# Altium schematic sheet PCB_3U_RJ45.schdoc: 3U RJ45
size 420 x 297 mm; Author: G.K.; CompanyName: WUT; DrawnBy: G.K.; Organization: CERN; Address1: Warsaw Univeristy of Technology; Address2: Nowowiejska 15/19; Revision: -; SheetNumber: -; SheetTotal: -; EDA_Number: ARTIQ; Projet: KASLI 3U subsystem; ModifiedBy: -; CreateDate: XX/XX/XXXX; CheckedDate: -; Title2: Extension board; DivGrp: ISE; Designer: G.K.; ModifiedDate: -; ProjectName: KASLI 3U subsystem
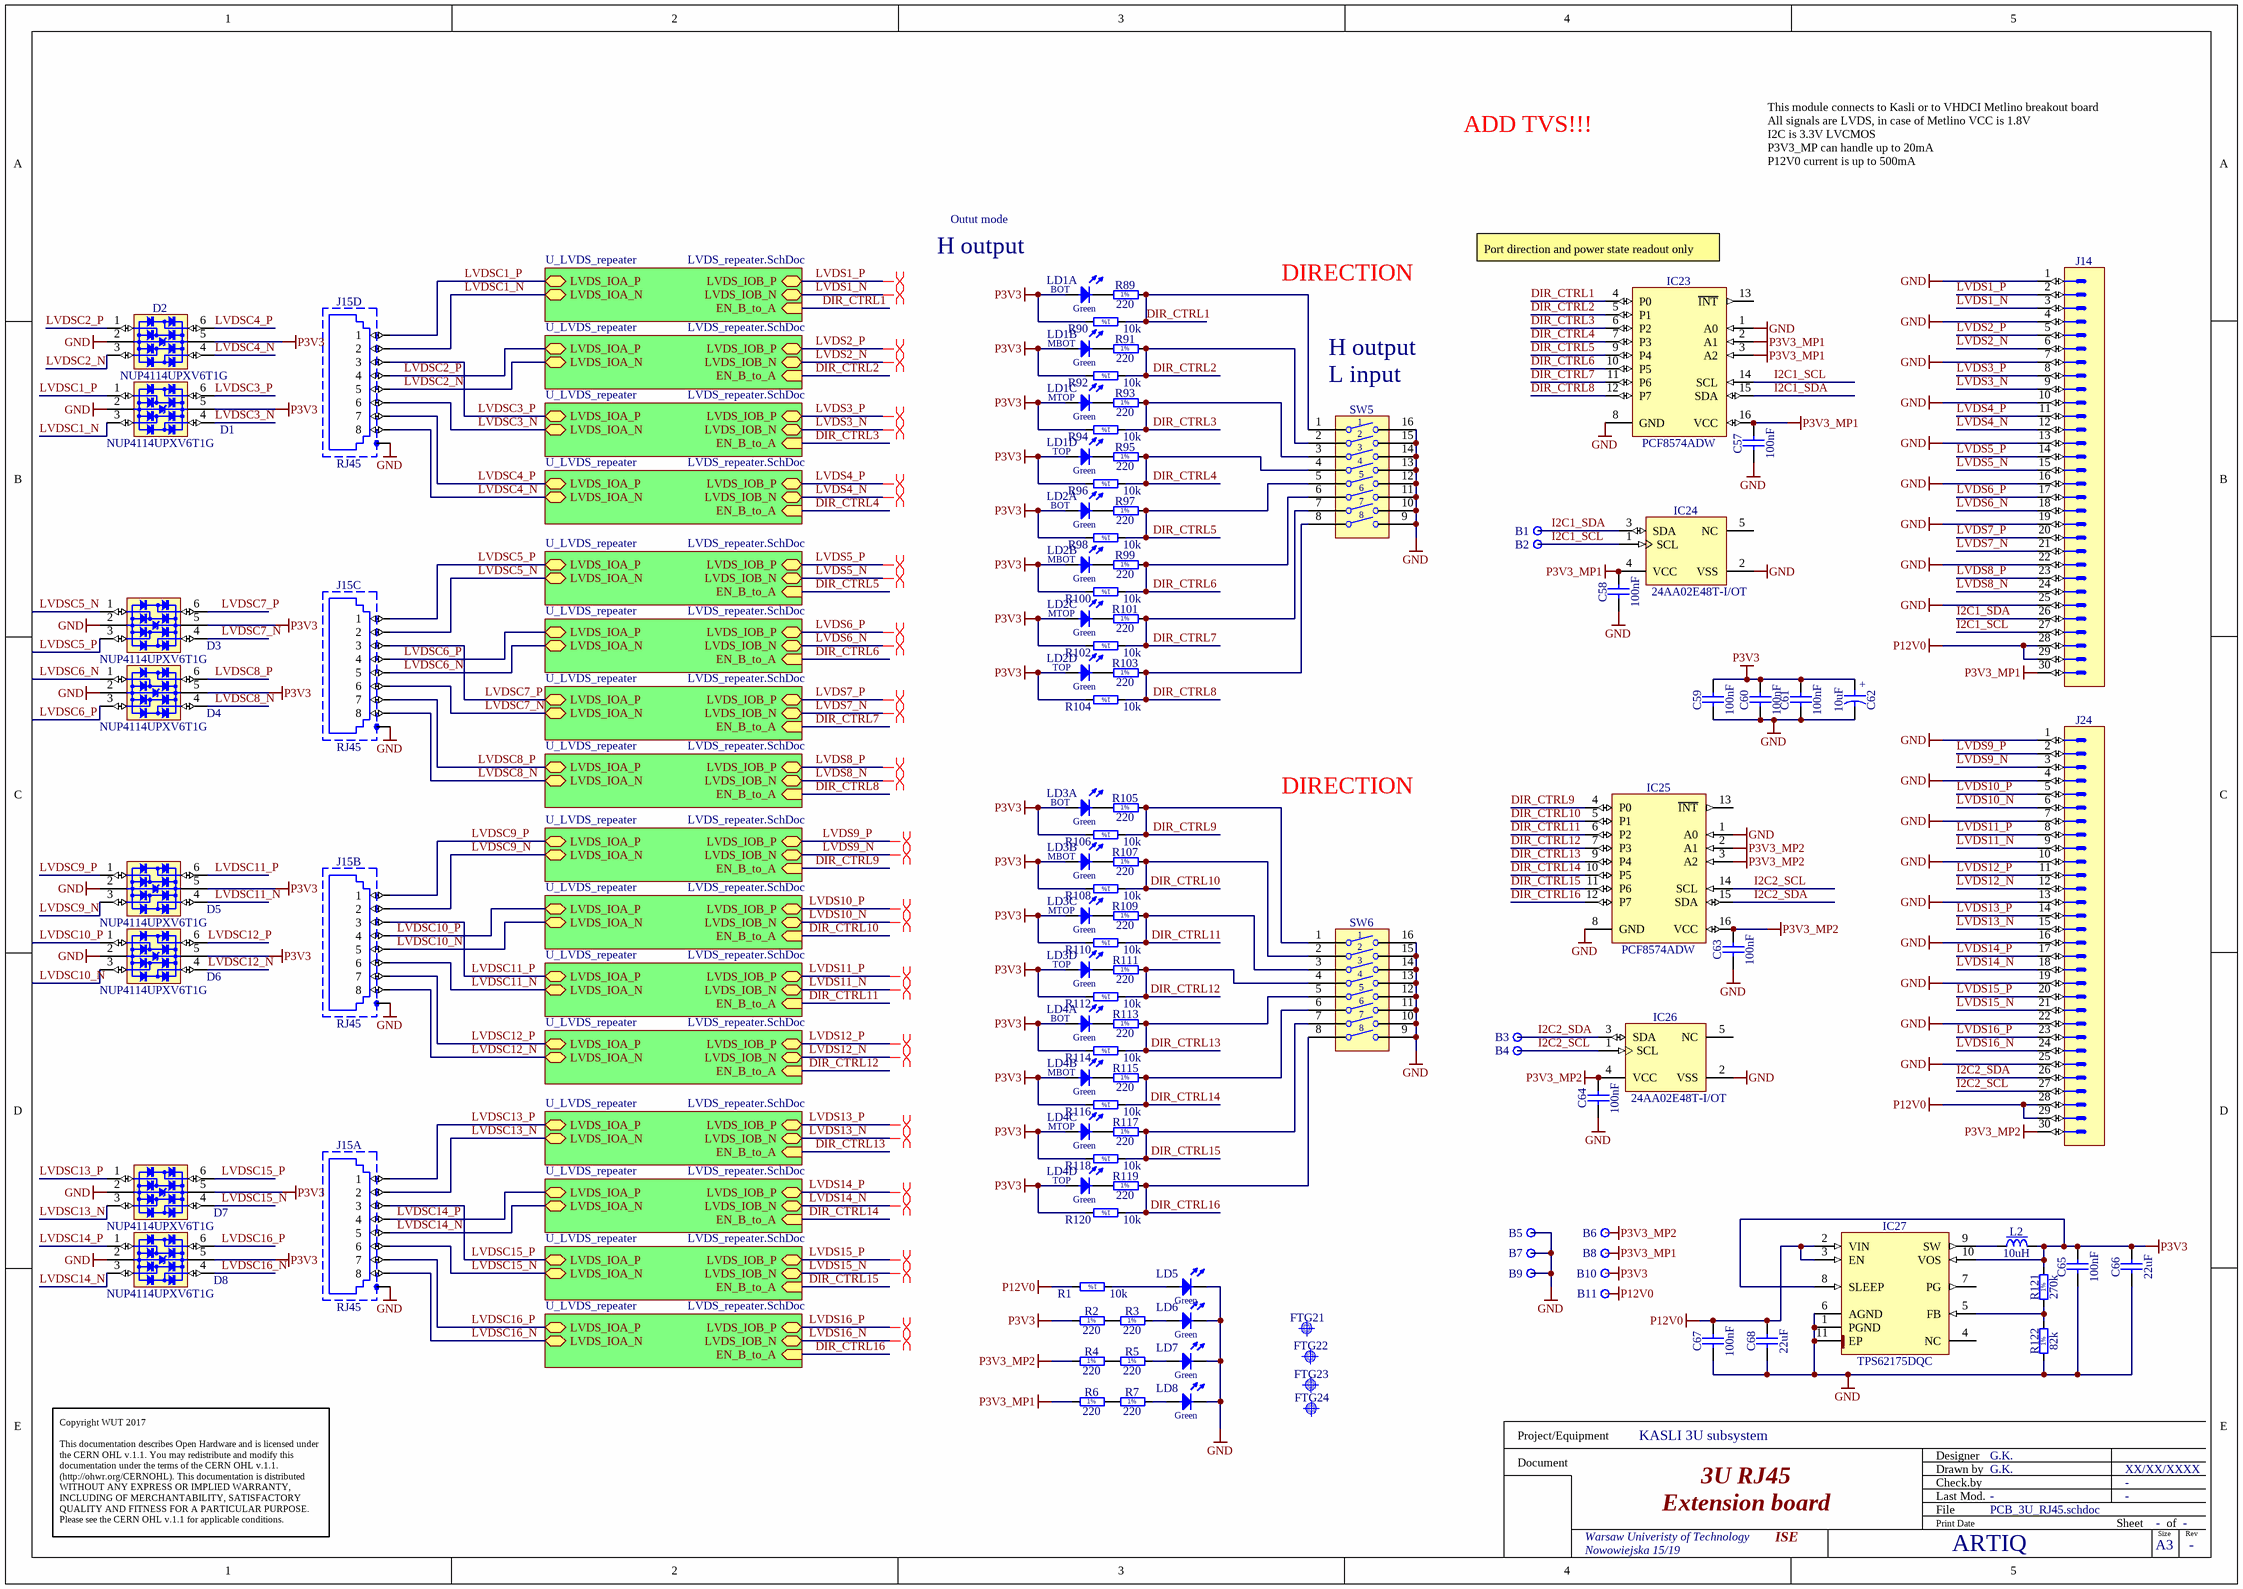
[diagram p0: PCB_3U_RJ45.schdoc]

## Parts
B1  Plated Hole  [c130h60]  (value not drawn)
B2  Plated Hole  [c130h60]  (value not drawn)
B3  Plated Hole  [c130h60]  (value not drawn)
B4  Plated Hole  [c130h60]  (value not drawn)
B5  Plated Hole  [c130h60]  (value not drawn)
B6  Plated Hole  [c130h60]  (value not drawn)
B7  Plated Hole  [c130h60]  (value not drawn)
B8  Plated Hole  [c130h60]  (value not drawn)
B9  Plated Hole  [c130h60]  (value not drawn)
B10  Plated Hole  [c130h60]  (value not drawn)
B11  Plated Hole  [c130h60]  (value not drawn)
C57  100nF  [CAPC1005X55N]
C58  100nF  [CAPC1005X55N]
C59  100nF  [CAPC1005X55N]
C60  100nF  [CAPC1005X55N]
C61  100nF  [CAPC1005X55N]
C62  10uF  [CAPAE430X540N]
C63  100nF  [CAPC1005X55N]
C64  100nF  [CAPC1005X55N]
C65  100nF  [CAPC1005X55N]
C66  22uF  [CAPC2012X135N]
C67  100nF  [CAPC1005X55N]
C68  22uF  [CAPC2012X135N]
D1  NUP4114UPXV6T1G  [SOTFL50P160X60-6N]
D2  NUP4114UPXV6T1G  [SOTFL50P160X60-6N]
D3  NUP4114UPXV6T1G  [SOTFL50P160X60-6N]
D4  NUP4114UPXV6T1G  [SOTFL50P160X60-6N]
D5  NUP4114UPXV6T1G  [SOTFL50P160X60-6N]
D6  NUP4114UPXV6T1G  [SOTFL50P160X60-6N]
D7  NUP4114UPXV6T1G  [SOTFL50P160X60-6N]
D8  NUP4114UPXV6T1G  [SOTFL50P160X60-6N]
FTG21  Use only in PCB  [FIDUCIAL_TOP_C100-200]  (value not drawn)
FTG22  Use only in PCB  [FIDUCIAL_TOP_S100-200]  (value not drawn)
FTG23  Use only in PCB  [FIDUCIAL_TOP_S200-400]  (value not drawn)
FTG24  Use only in PCB  [FIDUCIAL_TOP_S100-200]  (value not drawn)
IC23  PCF8574ADW  [SOIC127P1030X265-16N]
IC24  24AA02E48T-I/OT  [SOT95P280X145-5N]
IC25  PCF8574ADW  [SOIC127P1030X265-16N]
IC26  24AA02E48T-I/OT  [SOT95P280X145-5N]
IC27  TPS62175DQC  [SON50P200X300X80-11N-R94X250]
J14  (no value)  [3M_N2530-6002RB]
J15  RJ45  [TYCO_5406203-3]  (parts A,B,C,D of 4)
J24  (no value)  [3M_N2530-6002RB]
L2  10uH  [IND_MURATA-PS_8400]
LD1  Green  [LED_BIVAR_H485CGDL]  (value not drawn)  (parts A,B,C,D of 4)
LD2  Green  [LED_BIVAR_H485CGDL]  (value not drawn)  (parts A,B,C,D of 4)
LD3  Green  [LED_BIVAR_H485CGDL]  (value not drawn)  (parts A,B,C,D of 4)
LD4  Green  [LED_BIVAR_H485CGDL]  (value not drawn)  (parts A,B,C,D of 4)
LD5  Green  [LED_KINGBRIGHT_KPH-1608CGCK]  (value not drawn)
LD6  Green  [LED_KINGBRIGHT_KPH-1608CGCK]  (value not drawn)
LD7  Green  [LED_KINGBRIGHT_KPH-1608CGCK]  (value not drawn)
LD8  Green  [LED_KINGBRIGHT_KPH-1608CGCK]  (value not drawn)
R1  10k  [RESC1005X40N]
R2  220  [RESC1608X55N]
R3  220  [RESC1608X55N]
R4  220  [RESC1608X55N]
R5  220  [RESC1608X55N]
R6  220  [RESC1608X55N]
R7  220  [RESC1608X55N]
R89  220  [RESC1608X55N]
R90  10k  [RESC1005X40N]
R91  220  [RESC1608X55N]
R92  10k  [RESC1005X40N]
R93  220  [RESC1608X55N]
R94  10k  [RESC1005X40N]
R95  220  [RESC1608X55N]
R96  10k  [RESC1005X40N]
R97  220  [RESC1608X55N]
R98  10k  [RESC1005X40N]
R99  220  [RESC1608X55N]
R100  10k  [RESC1005X40N]
R101  220  [RESC1608X55N]
R102  10k  [RESC1005X40N]
R103  220  [RESC1608X55N]
R104  10k  [RESC1005X40N]
R105  220  [RESC1608X55N]
R106  10k  [RESC1005X40N]
R107  220  [RESC1608X55N]
R108  10k  [RESC1005X40N]
R109  220  [RESC1608X55N]
R110  10k  [RESC1005X40N]
R111  220  [RESC1608X55N]
R112  10k  [RESC1005X40N]
R113  220  [RESC1608X55N]
R114  10k  [RESC1005X40N]
R115  220  [RESC1608X55N]
R116  10k  [RESC1005X40N]
R117  220  [RESC1608X55N]
R118  10k  [RESC1005X40N]
R119  220  [RESC1608X55N]
R120  10k  [RESC1005X40N]
R121  270k  [RESC1608X55N]
R122  82k  [RESC1608X55N]
SW5  Switch  [SW_TYCO_1-1571983-0]  (value not drawn)
SW6  Switch  [SW_TYCO_1-1571983-0]  (value not drawn)

## Sub-sheets
U_LVDS_repeater = LVDS_repeater.SchDoc: LVDS_IOA_P (bidir), LVDS_IOA_N (bidir), LVDS_IOB_P (bidir), LVDS_IOB_N (bidir), EN_B_to_A (in)
U_LVDS_repeater = LVDS_repeater.SchDoc: LVDS_IOA_P (bidir), LVDS_IOA_N (bidir), LVDS_IOB_P (bidir), LVDS_IOB_N (bidir), EN_B_to_A (in)
U_LVDS_repeater = LVDS_repeater.SchDoc: LVDS_IOA_P (bidir), LVDS_IOA_N (bidir), LVDS_IOB_P (bidir), LVDS_IOB_N (bidir), EN_B_to_A (in)
U_LVDS_repeater = LVDS_repeater.SchDoc: LVDS_IOA_P (bidir), LVDS_IOA_N (bidir), LVDS_IOB_P (bidir), LVDS_IOB_N (bidir), EN_B_to_A (in)
U_LVDS_repeater = LVDS_repeater.SchDoc: LVDS_IOA_P (bidir), LVDS_IOA_N (bidir), LVDS_IOB_P (bidir), LVDS_IOB_N (bidir), EN_B_to_A (in)
U_LVDS_repeater = LVDS_repeater.SchDoc: LVDS_IOA_P (bidir), LVDS_IOA_N (bidir), LVDS_IOB_P (bidir), LVDS_IOB_N (bidir), EN_B_to_A (in)
U_LVDS_repeater = LVDS_repeater.SchDoc: LVDS_IOA_P (bidir), LVDS_IOA_N (bidir), LVDS_IOB_P (bidir), LVDS_IOB_N (bidir), EN_B_to_A (in)
U_LVDS_repeater = LVDS_repeater.SchDoc: LVDS_IOA_P (bidir), LVDS_IOA_N (bidir), LVDS_IOB_P (bidir), LVDS_IOB_N (bidir), EN_B_to_A (in)
U_LVDS_repeater = LVDS_repeater.SchDoc: LVDS_IOA_P (bidir), LVDS_IOA_N (bidir), LVDS_IOB_P (bidir), LVDS_IOB_N (bidir), EN_B_to_A (in)
U_LVDS_repeater = LVDS_repeater.SchDoc: LVDS_IOA_P (bidir), LVDS_IOA_N (bidir), LVDS_IOB_P (bidir), LVDS_IOB_N (bidir), EN_B_to_A (in)
U_LVDS_repeater = LVDS_repeater.SchDoc: LVDS_IOA_P (bidir), LVDS_IOA_N (bidir), LVDS_IOB_P (bidir), LVDS_IOB_N (bidir), EN_B_to_A (in)
U_LVDS_repeater = LVDS_repeater.SchDoc: LVDS_IOA_P (bidir), LVDS_IOA_N (bidir), LVDS_IOB_P (bidir), LVDS_IOB_N (bidir), EN_B_to_A (in)
U_LVDS_repeater = LVDS_repeater.SchDoc: LVDS_IOA_P (bidir), LVDS_IOA_N (bidir), LVDS_IOB_P (bidir), LVDS_IOB_N (bidir), EN_B_to_A (in)
U_LVDS_repeater = LVDS_repeater.SchDoc: LVDS_IOA_P (bidir), LVDS_IOA_N (bidir), LVDS_IOB_P (bidir), LVDS_IOB_N (bidir), EN_B_to_A (in)
U_LVDS_repeater = LVDS_repeater.SchDoc: LVDS_IOA_P (bidir), LVDS_IOA_N (bidir), LVDS_IOB_P (bidir), LVDS_IOB_N (bidir), EN_B_to_A (in)
U_LVDS_repeater = LVDS_repeater.SchDoc: LVDS_IOA_P (bidir), LVDS_IOA_N (bidir), LVDS_IOB_P (bidir), LVDS_IOB_N (bidir), EN_B_to_A (in)

## Nets
GND: B5.1 B7.1 B9.1 C57.1 C58.1 C59.1 C60.1 C61.1 C62.2 C63.1 C64.1 C65.1 C66.1 C67.1 C68.1 D1.2(GND) D2.2(GND) D3.2(GND) D4.2(GND) D5.2(GND) D6.2(GND) D7.2(GND) D8.2(GND) IC23.1(A0) IC23.8(GND) IC24.2(VSS) IC25.1(A0) IC25.8(GND) IC26.2(VSS) IC27.1(PGND) IC27.6(AGND) IC27.11(EP) J14.1 J14.4 J14.7 J14.10 J14.13 J14.16 J14.19 J14.22 J14.25 J15.SH J24.1 J24.4 J24.7 J24.10 J24.13 J24.16 J24.19 J24.22 J24.25 LD5.1(C) LD6.1(C) LD7.1(C) LD8.1(C) R122.1 SW5.9 SW5.10 SW5.11 SW5.12 SW5.13 SW5.14 SW5.15 SW5.16 SW6.9 SW6.10 SW6.11 SW6.12 SW6.13 SW6.14 SW6.15 SW6.16
P3V3: B10.1 C59.2 C60.2 C61.2 C62.1 C65.2 C66.2 D1.5(VBUS) D2.5(VBUS) D3.5(VBUS) D4.5(VBUS) D5.5(VBUS) D6.5(VBUS) D7.5(VBUS) D8.5(VBUS) IC27.8(SLEEP) IC27.10(VOS) L2.2 LD1.2(A) LD1.4(A) LD1.6(A) LD1.8(A) LD2.2(A) LD2.4(A) LD2.6(A) LD2.8(A) LD3.2(A) LD3.4(A) LD3.6(A) LD3.8(A) LD4.2(A) LD4.4(A) LD4.6(A) LD4.8(A) R2.1 R90.2 R92.2 R94.2 R96.2 R98.2 R100.2 R102.2 R104.2 R106.2 R108.2 R110.2 R112.2 R114.2 R116.2 R118.2 R120.2 R121.2
P3V3_MP1: B8.1 C57.2 C58.2 IC23.2(A1) IC23.3(A2) IC23.16(VCC) IC24.4(VCC) J14.30 R6.1
P3V3_MP2: B6.1 C63.2 C64.2 IC25.2(A1) IC25.3(A2) IC25.16(VCC) IC26.4(VCC) J24.30 R4.1
P12V0: B11.1 C67.2 C68.2 IC27.2(VIN) IC27.3(EN) J14.28 J14.29 J24.28 J24.29 R1.2
DIR_CTRL1: IC23.4(P0) R89.2 R90.1 SW5.1 ; sheet U_LVDS_repeater/EN_B_to_A
DIR_CTRL2: IC23.5(P1) R91.2 R92.1 SW5.2 ; sheet U_LVDS_repeater/EN_B_to_A
DIR_CTRL3: IC23.6(P2) R93.2 R94.1 SW5.3 ; sheet U_LVDS_repeater/EN_B_to_A
DIR_CTRL4: IC23.7(P3) R95.2 R96.1 SW5.4 ; sheet U_LVDS_repeater/EN_B_to_A
DIR_CTRL5: IC23.9(P4) R97.2 R98.1 SW5.5 ; sheet U_LVDS_repeater/EN_B_to_A
DIR_CTRL6: IC23.10(P5) R99.2 R100.1 SW5.6 ; sheet U_LVDS_repeater/EN_B_to_A
DIR_CTRL7: IC23.11(P6) R101.2 R102.1 SW5.7 ; sheet U_LVDS_repeater/EN_B_to_A
DIR_CTRL8: IC23.12(P7) R103.2 R104.1 SW5.8 ; sheet U_LVDS_repeater/EN_B_to_A
DIR_CTRL9: IC25.4(P0) R105.2 R106.1 SW6.1 ; sheet U_LVDS_repeater/EN_B_to_A
DIR_CTRL10: IC25.5(P1) R107.2 R108.1 SW6.2 ; sheet U_LVDS_repeater/EN_B_to_A
DIR_CTRL11: IC25.6(P2) R109.2 R110.1 SW6.3 ; sheet U_LVDS_repeater/EN_B_to_A
DIR_CTRL12: IC25.7(P3) R111.2 R112.1 SW6.4 ; sheet U_LVDS_repeater/EN_B_to_A
DIR_CTRL13: IC25.9(P4) R113.2 R114.1 SW6.5 ; sheet U_LVDS_repeater/EN_B_to_A
DIR_CTRL14: IC25.10(P5) R115.2 R116.1 SW6.6 ; sheet U_LVDS_repeater/EN_B_to_A
DIR_CTRL15: IC25.11(P6) R117.2 R118.1 SW6.7 ; sheet U_LVDS_repeater/EN_B_to_A
DIR_CTRL16: IC25.12(P7) R119.2 R120.1 SW6.8 ; sheet U_LVDS_repeater/EN_B_to_A
I2C1_SCL: B2.1 IC23.14(SCL) IC24.1(SCL) J14.27
I2C1_SDA: B1.1 IC23.15(SDA) IC24.3(SDA) J14.26
I2C2_SCL: B4.1 IC25.14(SCL) IC26.1(SCL) J24.27
I2C2_SDA: B3.1 IC25.15(SDA) IC26.3(SDA) J24.26
LVDS1_N: J14.3 ; sheet U_LVDS_repeater/LVDS_IOB_N
LVDS1_P: J14.2 ; sheet U_LVDS_repeater/LVDS_IOB_P
LVDS2_N: J14.6 ; sheet U_LVDS_repeater/LVDS_IOB_N
LVDS2_P: J14.5 ; sheet U_LVDS_repeater/LVDS_IOB_P
LVDS3_N: J14.9 ; sheet U_LVDS_repeater/LVDS_IOB_N
LVDS3_P: J14.8 ; sheet U_LVDS_repeater/LVDS_IOB_P
LVDS4_N: J14.12 ; sheet U_LVDS_repeater/LVDS_IOB_N
LVDS4_P: J14.11 ; sheet U_LVDS_repeater/LVDS_IOB_P
LVDS5_N: J14.15 ; sheet U_LVDS_repeater/LVDS_IOB_N
LVDS5_P: J14.14 ; sheet U_LVDS_repeater/LVDS_IOB_P
LVDS6_N: J14.18 ; sheet U_LVDS_repeater/LVDS_IOB_N
LVDS6_P: J14.17 ; sheet U_LVDS_repeater/LVDS_IOB_P
LVDS7_N: J14.21 ; sheet U_LVDS_repeater/LVDS_IOB_N
LVDS7_P: J14.20 ; sheet U_LVDS_repeater/LVDS_IOB_P
LVDS8_N: J14.24 ; sheet U_LVDS_repeater/LVDS_IOB_N
LVDS8_P: J14.23 ; sheet U_LVDS_repeater/LVDS_IOB_P
LVDS9_N: J24.3 ; sheet U_LVDS_repeater/LVDS_IOB_N
LVDS9_P: J24.2 ; sheet U_LVDS_repeater/LVDS_IOB_P
LVDS10_N: J24.6 ; sheet U_LVDS_repeater/LVDS_IOB_N
LVDS10_P: J24.5 ; sheet U_LVDS_repeater/LVDS_IOB_P
LVDS11_N: J24.9 ; sheet U_LVDS_repeater/LVDS_IOB_N
LVDS11_P: J24.8 ; sheet U_LVDS_repeater/LVDS_IOB_P
LVDS12_N: J24.12 ; sheet U_LVDS_repeater/LVDS_IOB_N
LVDS12_P: J24.11 ; sheet U_LVDS_repeater/LVDS_IOB_P
LVDS13_N: J24.15 ; sheet U_LVDS_repeater/LVDS_IOB_N
LVDS13_P: J24.14 ; sheet U_LVDS_repeater/LVDS_IOB_P
LVDS14_N: J24.18 ; sheet U_LVDS_repeater/LVDS_IOB_N
LVDS14_P: J24.17 ; sheet U_LVDS_repeater/LVDS_IOB_P
LVDS15_N: J24.21 ; sheet U_LVDS_repeater/LVDS_IOB_N
LVDS15_P: J24.20 ; sheet U_LVDS_repeater/LVDS_IOB_P
LVDS16_N: J24.24 ; sheet U_LVDS_repeater/LVDS_IOB_N
LVDS16_P: J24.23 ; sheet U_LVDS_repeater/LVDS_IOB_P
LVDSC1_N: D1.3(I/O2) J15.2D(2) ; sheet U_LVDS_repeater/LVDS_IOA_N
LVDSC1_P: D1.1(I/O1) J15.1D(1) ; sheet U_LVDS_repeater/LVDS_IOA_P
LVDSC2_N: D2.3(I/O2) J15.5D(5) ; sheet U_LVDS_repeater/LVDS_IOA_N
LVDSC2_P: D2.1(I/O1) J15.4D(4) ; sheet U_LVDS_repeater/LVDS_IOA_P
LVDSC3_N: D1.4(I/O3) J15.6D(6) ; sheet U_LVDS_repeater/LVDS_IOA_N
LVDSC3_P: D1.6(I/O4) J15.3D(3) ; sheet U_LVDS_repeater/LVDS_IOA_P
LVDSC4_N: D2.4(I/O3) J15.8D(8) ; sheet U_LVDS_repeater/LVDS_IOA_N
LVDSC4_P: D2.6(I/O4) J15.7D(7) ; sheet U_LVDS_repeater/LVDS_IOA_P
LVDSC5_N: D3.1(I/O1) J15.2C(2) ; sheet U_LVDS_repeater/LVDS_IOA_N
LVDSC5_P: D3.3(I/O2) J15.1C(1) ; sheet U_LVDS_repeater/LVDS_IOA_P
LVDSC6_N: D4.1(I/O1) J15.5C(5) ; sheet U_LVDS_repeater/LVDS_IOA_N
LVDSC6_P: D4.3(I/O2) J15.4C(4) ; sheet U_LVDS_repeater/LVDS_IOA_P
LVDSC7_N: D3.4(I/O3) J15.6C(6) ; sheet U_LVDS_repeater/LVDS_IOA_N
LVDSC7_P: D3.6(I/O4) J15.3C(3) ; sheet U_LVDS_repeater/LVDS_IOA_P
LVDSC8_N: D4.4(I/O3) J15.8C(8) ; sheet U_LVDS_repeater/LVDS_IOA_N
LVDSC8_P: D4.6(I/O4) J15.7C(7) ; sheet U_LVDS_repeater/LVDS_IOA_P
LVDSC9_N: D5.3(I/O2) J15.2B(2) ; sheet U_LVDS_repeater/LVDS_IOA_N
LVDSC9_P: D5.1(I/O1) J15.1B(1) ; sheet U_LVDS_repeater/LVDS_IOA_P
LVDSC10_N: D6.3(I/O2) J15.5B(5) ; sheet U_LVDS_repeater/LVDS_IOA_N
LVDSC10_P: D6.1(I/O1) J15.4B(4) ; sheet U_LVDS_repeater/LVDS_IOA_P
LVDSC11_N: D5.4(I/O3) J15.6B(6) ; sheet U_LVDS_repeater/LVDS_IOA_N
LVDSC11_P: D5.6(I/O4) J15.3B(3) ; sheet U_LVDS_repeater/LVDS_IOA_P
LVDSC12_N: D6.4(I/O3) J15.8B(8) ; sheet U_LVDS_repeater/LVDS_IOA_N
LVDSC12_P: D6.6(I/O4) J15.7B(7) ; sheet U_LVDS_repeater/LVDS_IOA_P
LVDSC13_N: D7.3(I/O2) J15.2A(2) ; sheet U_LVDS_repeater/LVDS_IOA_N
LVDSC13_P: D7.1(I/O1) J15.1A(1) ; sheet U_LVDS_repeater/LVDS_IOA_P
LVDSC14_N: D8.3(I/O2) J15.5A(5) ; sheet U_LVDS_repeater/LVDS_IOA_N
LVDSC14_P: D8.1(I/O1) J15.4A(4) ; sheet U_LVDS_repeater/LVDS_IOA_P
LVDSC15_N: D7.4(I/O3) J15.6A(6) ; sheet U_LVDS_repeater/LVDS_IOA_N
LVDSC15_P: D7.6(I/O4) J15.3A(3) ; sheet U_LVDS_repeater/LVDS_IOA_P
LVDSC16_N: D8.4(I/O3) J15.8A(8) ; sheet U_LVDS_repeater/LVDS_IOA_N
LVDSC16_P: D8.6(I/O4) J15.7A(7) ; sheet U_LVDS_repeater/LVDS_IOA_P
NetIC27_5: IC27.5(FB) R121.1 R122.2
NetIC27_9: IC27.9(SW) L2.1
NetLD1_1: LD1.1(C) R89.1
NetLD1_3: LD1.3(C) R91.1
NetLD1_5: LD1.5(C) R93.1
NetLD1_7: LD1.7(C) R95.1
NetLD2_1: LD2.1(C) R97.1
NetLD2_3: LD2.3(C) R99.1
NetLD2_5: LD2.5(C) R101.1
NetLD2_7: LD2.7(C) R103.1
NetLD3_1: LD3.1(C) R105.1
NetLD3_3: LD3.3(C) R107.1
NetLD3_5: LD3.5(C) R109.1
NetLD3_7: LD3.7(C) R111.1
NetLD4_1: LD4.1(C) R113.1
NetLD4_3: LD4.3(C) R115.1
NetLD4_5: LD4.5(C) R117.1
NetLD4_7: LD4.7(C) R119.1
NetLD5_2: LD5.2(A) R1.1
NetLD6_2: LD6.2(A) R3.2
NetLD7_2: LD7.2(A) R5.2
NetLD8_2: LD8.2(A) R7.2
NetR2_2: R2.2 R3.1
NetR4_2: R4.2 R5.1
NetR6_2: R6.2 R7.1

Not connected (* = marked no-connect by the designer): IC23 13(~{INT}); IC24 5(NC); IC25 13(~{INT}); IC26 5(NC); IC27 4(NC) 7(PG)

## Layout directives
differential pair: LVDS1_N, LVDS1_P, LVDS2_N, LVDS2_P, LVDS3_N, LVDS3_P, LVDS4_N, LVDS4_P, LVDS5_N, LVDS5_P, LVDS6_N, LVDS6_P, LVDS7_N, LVDS7_P, LVDS8_N, LVDS8_P, LVDS9_N, LVDS9_P, LVDS10_N, LVDS10_P, LVDS11_N, LVDS11_P, LVDS12_N, LVDS12_P, LVDS13_N, LVDS13_P, LVDS14_N, LVDS14_P, LVDS15_N, LVDS15_P, LVDS16_N, LVDS16_P

## Notes on the sheet
- ADD TVS!!!
- This module connects to Kasli or to VHDCI Metlino breakout board
  All signals are LVDS, in case of Metlino VCC is 1.8V
  I2C is 3.3V LVCMOS
  P3V3_MP can handle up to 20mA
  P12V0 current is up to 500mA
- H output
- Outut mode
- (near IC23) Port direction and power state readout only
- DIRECTION
- (near SW5) L input
- Copyright WUT 2017
  This documentation describes Open Hardware and is licensed under the CERN OHL v.1.1. You may redistribute and modify this documentation under the terms of the CERN OHL v.1.1. (http://ohwr.org/CERNOHL). This documentation is distributed WITHOUT ANY EXPRESS OR IMPLIED WARRANTY, INCLUDING OF MERCHANTABILITY, SATISFACTORY QUALITY AND FITNESS FOR A PARTICULAR PURPOSE. Please see the CERN OHL v.1.1 for applicable conditions.
- Project/Equipment
- Document
- Designer
- Drawn by
- Check.by
- File
- Last Mod.
- Print Date
- Sheet
- Size
- A3
- of
- Rev
- (in symbol CAE430-540_10UF_16V_20%) +
- (in symbol LED_BIVAR_H485CGDL, part A) BOT
- (in symbol LED_BIVAR_H485CGDL, part B) MBOT
- (in symbol LED_BIVAR_H485CGDL, part C) MTOP
- (in symbol LED_BIVAR_H485CGDL, part D) TOP
- (in symbol R0402_10K_1%_0.0625W_100PPM) 1%
- (in symbol R0603_82K_1%_0.1W_100PPM) 1%
- (in symbol R0603_220R_1%_0.1W_100PPM) 1%
- (in symbol R0603_270K_1%_0.1W_100PPM) 1%

## Library data of the parts
B1-B11 = PLATED_HOLE0.6_PAD1.3: Single Terminal Socket; Part Description: Plated Through Hole: Hole Dia.=0.6mm Pad Dia.=1.3mm; Mounted: No; Part Number: PLATED_HOLE0.6_PAD1.3; Component Kind: Standard (No BOM); Component Type: Standard (No BOM); Pin Count: 1; Family: Plated Hole; Socket: No; SMD: No; Sense: No; Status: None; ComponentHeight: 0mm; HelpURL: Undefined; Author: CERN DEM MR; CreateDate: 02.03.2016; LatestRevisionDate: 02.03.2016; PackageDescription: Plated Through Hole: Hole Dia.=0.6mm Pad Dia.=1.3mm
C57-C61 C63-C65 C67 = CC0402_100NF_16V_10%_X5R: Non-polarised capacitor; Part Description: SMD Multilayer Chip Ceramic Capacitor; Manufacturer: GENERIC; Manufacturer1 Part Number: GRM155R61C104KA88D; Voltage: 16V; TC: X5R; Tolerance: ±10%; Part Number: CC0402_100NF_16V_10%_X5R; Component Kind: Standard; Component Type: Standard; Pin Count: 2; Value: 100nF; Status: None; Manufacturer Part Number: CC0402_100NF_16V_10%_X5R; Case: 0402; Mounted: Yes; Socket: No; SMD: Yes; Sense: No; Manufacturer1 Example: MURATA; Manufacturer1 ComponentHeight: 0.55mm; HelpURL: \\cern.ch\dfs\Applications\Altium\Datasheets\CC0402_X5R_MURATA_GRM.pdf; Author: CERN DEM JLC; CreateDate: 10.12.2013; LatestRevisionDate: 10.12.2013
C62 = CAE430-540_10UF_16V_20%: Polarised capacitor; Part Description: Aluminum Electrolytic SMT Capacitor; Manufacturer: PANASONIC; Manufacturer Part Number: EEEFK1C100AR; Voltage: 16V; Tolerance: ±20%; Part Number: CAE430-540_10UF_16V_20%; Component Kind: Standard; Component Type: Standard; Pin Count: 2; Value: 10uF; Status: Not Recommended; Case: B; Mounted: Yes; Socket: No; SMD: Yes; Sense: No; ComponentHeight: 5.8mm; HelpURL: \\cern.ch\dfs\Applications\Altium\Datasheets\CAE_PANASONIC_FK.pdf; Author: CERN DEM JLC; CreateDate: 03.12.2007; LatestRevisionDate: 05.11.2014
C66 C68 = CC0805_22UF_16V_10%_X5R: Non-polarised capacitor; Part Description: SMD Multilayer Chip Ceramic Capacitor; Manufacturer: GENERIC; Manufacturer1 Part Number: C2012X5R1C226KT; Voltage: 16V; TC: X5R; Tolerance: ±10%; Part Number: CC0805_22UF_16V_10%_X5R; Component Kind: Standard; Component Type: Standard; Pin Count: 2; Value: 22uF; Status: Preferred; Manufacturer Part Number: CC0805_22UF_16V_10%_X5R; Case: 0805; Mounted: Yes; Socket: No; SMD: Yes; Sense: No; Manufacturer1 Example: TDK; Manufacturer1 ComponentHeight: 1.35mm; HelpURL: \\cern.ch\dfs\Applications\Altium\Datasheets\CC0805_X5R_TDK_C.pdf; Author: CERN DEM JLC; CreateDate: 25.10.2012; LatestRevisionDate: 25.10.2012
D1-D8 = NUP4114UPXV6T1G: Part Description: ESD Protection Diodes Array (8kV) with Low Clamping Voltage; Manufacturer: ON SEMICONDUCTOR; Voltage: 5.5V; PressFit: No; Bonding: No; Part Number: NUP4114UPXV6T1G; Component Kind: Standard; Component Type: Standard; Device: NUP4114UPXV6T1G; PackageDescription: SOTFL (SOT666, SOT563,), 0.50mm, Pitch; 6 Pin, 1.20mm W X 1.60mm L X 0.60mm H Body, IPC Medium Density; Manufacturer Part Number: NUP4114UPXV6T1G; Pin Count: 8; Mounted: Yes; Socket: No; SMD: Yes; Sense: No; ComponentHeight: 1.75mm; HelpURL: \\cern.ch\dfs\Applications\Altium\Datasheets\NUP4114UPXV6T1G.pdf; Author: CERN DEM JLC; CreateDate: 05.12.2012; LatestRevisionDate: 05.12.2012
FTG21 = FIDUCIAL_TARGET_C100-200: Fiducial Target; Part Description: Round Fiducial Target, Top Layer, 1.0mm, Top Solder 2.0mm, Keepout =2.0mm; Mounted: No; Part Number: FIDUCIAL_TARGET_C100-200; Component Kind: Standard (No BOM); Component Type: Standard (No BOM); Pin Count: 1; Family: Fiducial; Socket: No; SMD: Yes; Sense: No; Status: None; ComponentHeight: 0mm; HelpURL: Undefined; Author: CERN DEM JLC; CreateDate: 09.02.2010; LatestRevisionDate: 04.04.2012; PackageDescription: Round Fiducial Target, Top Layer, 1.0mm, Top Solder 2.0mm, Keepout =2.0mm
FTG22 FTG24 = FIDUCIAL_TARGET_S100-200: Fiducial Target; Part Description: Square Fiducial Target, Top Layer, 1.0mm, Top Solder 2.0mm, Keepout =2.0mm; Mounted: No; Part Number: FIDUCIAL_TARGET_S100-200; Component Kind: Standard (No BOM); Component Type: Standard (No BOM); Pin Count: 1; Family: Fiducial; Socket: No; SMD: Yes; Sense: No; Status: None; ComponentHeight: 0mm; HelpURL: Undefined; Author: CERN DEM JLC; CreateDate: 09.02.2010; LatestRevisionDate: 04.04.2012; PackageDescription: Square Fiducial Target, Top Layer, 1.0mm, Top Solder 2.0mm, Keepout =2.0mm
FTG23 = FIDUCIAL_TARGET_S200-400: Fiducial Target; Part Description: Square Fiducial Target, Top Layer, 2.0mm, Top Solder 4.0mm, Keepout =4.0mm; Mounted: No; Part Number: FIDUCIAL_TARGET_S200-400; Component Kind: Standard (No BOM); Component Type: Standard (No BOM); Pin Count: 1; Family: Fiducial; Socket: No; SMD: Yes; Sense: No; Status: None; ComponentHeight: 0mm; HelpURL: Undefined; Author: CERN DEM JLC; CreateDate: 02.06.2008; LatestRevisionDate: 04.04.2012; PackageDescription: Square Fiducial Target, Top Layer, 2.0mm, Top Solder 4.0mm, Keepout =4.0mm
IC23 IC25 = PCF8574ADW: Remote 8-bit I/O Expander For I2C Bus; Manufacturer: TEXAS INSTRUMENTS; PressFit: No; Bonding: No; Part Number: PCF8574ADW; Component Kind: Standard; Component Type: Standard; Device: PCF8574ADW; PackageDescription: SOIC 16, Pitch 1.27mm - Body 7.5x10.3mm, IPC Medium Density; Part Description: Remote 8-bit I/O Expander For I2C Bus; Manufacturer Part Number: PCF8574ADW; Pin Count: 16; Case: SOIC16W; Mounted: Yes; Socket: No; SMD: Yes; Sense: No; ComponentHeight: 2.65mm; Author: CERN DEM JLC; HelpURL: \\cern.ch\dfs\Applications\Altium\Datasheets\PCF8574ADW.pdf; CreateDate: 01.11.2012; LatestRevisionDate: 01.11.2012
IC24 IC26 = 24AA02E48T-I/OT: 1.7V-5.5V, 2K I2C Serial EEPROM With EUI-48 Node Identity; Manufacturer: MICROCHIP TECHNOLOGY; PressFit: No; Bonding: No; Part Number: 24AA02E48T-I/OT; Component Kind: Standard; Component Type: Standard; Device: 24AA02E48T-I/OT; PackageDescription: SOT, 0.95mm pitch; 5 pin, 1.60mm W X 2.90mm L X 1.45mm H body, IPC Medium Density; Part Description: 1.7V-5.5V, 2K I2C Serial EEPROM With EUI-48 Node Identity; Manufacturer Part Number: 24AA02E48T-I/OT; Pin Count: 5; Case: SOT23-5; Mounted: Yes; Socket: No; SMD: Yes; Sense: No; ComponentHeight: 1.45mm; HelpURL: \\cern.ch\dfs\Applications\Altium\Datasheets\24AA02E48T-I-OT.pdf; Author: CERN DEM MR; CreateDate: 31.03.2016; LatestRevisionDate: 31.03.2016
IC27 = TPS62175DQC: 4.75-28VDC to 1-6VDC, 500mA Step-Down Converter With Sleep Mode; Manufacturer: TEXAS INSTRUMENTS; PressFit: No; Bonding: No; Part Number: TPS62175DQC; Component Kind: Standard; Component Type: Standard; Device: TPS62175DQC; PackageDescription: SON, 10-Leads, Body 2x3mm, Pitch 0.5mm, Thermal Pad 0.94x2.5mm, IPC Medium Density; Part Description: 4.75-28VDC to 1-6VDC, 500mA Step-Down Converter With Sleep Mode; Manufacturer Part Number: TPS62175DQC; Pin Count: 11; Case: SON10; Mounted: Yes; Socket: No; SMD: Yes; Sense: No; ComponentHeight: 0.8mm; HelpURL: \\cern.ch\dfs\Applications\Altium\Datasheets\TPS62175DQC.pdf; Author: CERN DEM JMW; CreateDate: 11.08.2015; LatestRevisionDate: 11.08.2015
J14 J24 = 3M_N2530-6002RB: Connector 30 Male; Part Description: 30 Contacts - Straight .100'' x .100'' Low Profile Four-Wall Header, 2500 Series; Manufacturer: 3M; PressFit: No; Part Number: 3M_N2530-6002RB; Component Kind: Standard; Component Type: Standard; Pin Count: 30; Family: Header 30; Mounted: Yes; Socket: No; SMD: No; Sense: No; Status: None; Manufacturer Part Number: N2530-6002RB; ComponentHeight: 10.03mm; HelpURL: \\cern.ch\dfs\Applications\Altium\Datasheets\3M_N2530-6002RB.pdf; Author: CERN DEM JLC; CreateDate: 11.02.2009; LatestRevisionDate: 11.08.2009
J15 = TYCO_5406203-3: Connector 4 x RJ45 + Shield; Part Description: Modular RJ45 Jack, 4 Port, 8 Positions, Shielded, Reverse Panel Ground Tabs, Category 5; Manufacturer: TYCO ELECTRONICS; PressFit: No; Part Number: TYCO_5406203-3; Component Kind: Standard; Component Type: Standard; Pin Count: 33; Family: RJ45; Mounted: Yes; Socket: No; SMD: No; Sense: No; Status: None; Manufacturer Part Number: 5406203-3; ComponentHeight: 13.64mm; HelpURL: \\cern.ch\dfs\Applications\Altium\Datasheets\TYCO_5406203-3.pdf; Author: CERN DEM JLC; CreateDate: 30.10.2008; LatestRevisionDate: 30.10.2008
L2 = IND_10UH_10%_MURATA-PS_8400: Inductor With Core; Part Description: Miniature Surface Mount Power Inductor (8400 Serie); Manufacturer: MURATA POWER SOLUTIONS; Manufacturer Part Number: 84103C; Power: 950mA; Resistance: 0.24R; Tolerance: ±10%; Part Number: IND_10UH_10%_MURATA-PS_8400; Component Kind: Standard; Component Type: Standard; Pin Count: 2; Value: 10uH; Status: None; Mounted: Yes; Socket: No; SMD: Yes; Sense: No; ComponentHeight: 2.9mm; HelpURL: \\cern.ch\dfs\Applications\Altium\Datasheets\IND_MURATA-PS_8400.pdf; Author: CERN DEM JLC; CreateDate: 02.07.2012; LatestRevisionDate: 02.07.2012
LD1-LD4 = LED_BIVAR_H485CGDL: LED x4 Green 1C2A-BOT_3C4A_5C6A_7C8A-TOP; Part Description: Quad-Level 2mm Green LED, PCB Edge Mounting; Manufacturer: BIVAR; PressFit: No; Bonding: No; Part Number: LED_BIVAR_H485CGDL; Component Kind: Standard; Component Type: Standard; Color: Green; PackageDescription: Quad-Level 2mm Green, PCB Edge Mounting  BIVAR H485CHDL; Manufacturer Part Number: H485CGDL; Pin Count: 8; Mounted: Yes; Socket: No; SMD: No; Sense: No; ComponentHeight: 11.3mm; HelpURL: \\cern.ch\dfs\Applications\Altium\Datasheets\LED_BIVAR_H485CGDL.pdf; Author: CERN DEM JLC; CreateDate: 04.06.2012; LatestRevisionDate: 04.06.2012
LD5-LD8 = LED_KINGBRIGHT_KPH-1608CGCK: LED Green 1C 2A; Part Description: SMD Green LED, Case 1.6mmX0.8mm(0603), 0.65mm Thickness; PressFit: No; Bonding: No; Part Number: LED_KINGBRIGHT_KPH-1608CGCK; Component Kind: Standard; Component Type: Standard; Color: Green; PackageDescription: SMT Green LED, Case 0603, Body L 1.6 x W 0.8mm H 0.65mm; Manufacturer: KINGBRIGHT; Manufacturer Part Number: KPH-1608CGCK; Pin Count: 2; Mounted: Yes; Socket: No; SMD: Yes; Sense: No; ComponentHeight: 0.65mm; HelpURL: \\cern.ch\dfs\Applications\Altium\Datasheets\LED_KINGBRIGHT_KPH-1608CGCK.pdf; Author: CERN DEM JLC; CreateDate: 03.07.2017; LatestRevisionDate: 03.07.2017
R1 R90 R92 R94 R96 R98 R100 R102 R104 R106 R108 R110 R112 R114 R116 R118 R120 = R0402_10K_1%_0.0625W_100PPM: Resistor - 1%; Part Description: General Purpose Thick Film Chip Resistor; Manufacturer: GENERIC; Manufacturer1 Part Number: 232270671003L; TC: ±100ppm/°C; Part Number: R0402_10K_1%_0.0625W_100PPM; Component Kind: Standard; Component Type: Standard; Pin Count: 2; Value: 10k; Status: Not recommended; Power: 0.0625W; Tolerance: ±1%; Manufacturer Part Number: R0402_10K_1%_0.0625W_100PPM; Case: 0402; Mounted: Yes; Sense: No; Socket: No; SMD: Yes; Manufacturer1 Example: YAGEO PHYCOMP; Manufacturer1 ComponentHeight: 0.4mm; HelpURL: \\cern.ch\dfs\Applications\Altium\Datasheets\R0402_Phycomp_RC0402.pdf; Author: CERN DEM JLC; CreateDate: 03.12.2007; LatestRevisionDate: 17.10.2012
R2-R7 R89 R91 R93 R95 R97 R99 R101 R103 R105 R107 R109 R111 R113 R115 R117 R119 = R0603_220R_1%_0.1W_100PPM: Resistor - 1%; Part Description: General Purpose Thick Film Chip Resistor; Manufacturer: GENERIC; Manufacturer1 Part Number: NRC06F2200TRF; Power: 0.1W; TC: ±100ppm/°C; Part Number: R0603_220R_1%_0.1W_100PPM; Component Kind: Standard; Component Type: Standard; Pin Count: 2; Value: 220; Status: Preferred; Tolerance: ±1%; Manufacturer Part Number: R0603_220R_1%_0.1W_100PPM; Case: 0603; Mounted: Yes; Sense: No; Socket: No; SMD: Yes; Manufacturer1 Example: NIC COMPONENT; Manufacturer1 ComponentHeight: 0.55mm; HelpURL: \\cern.ch\dfs\Applications\Altium\Datasheets\R0603_NIC_NRC.pdf; Author: CERN DEM JLC; CreateDate: 03.12.2007; LatestRevisionDate: 13.03.2008
R121 = R0603_270K_1%_0.1W_100PPM: Resistor - 1%; Part Description: General Purpose Thick Film Chip Resistor; Manufacturer: GENERIC; Manufacturer1 Part Number: NRC06F2703TRF; Power: 0.1W; TC: ±100ppm/°C; Part Number: R0603_270K_1%_0.1W_100PPM; Component Kind: Standard; Component Type: Standard; Pin Count: 2; Value: 270k; Status: Preferred; Tolerance: ±1%; Manufacturer Part Number: R0603_270K_1%_0.1W_100PPM; Case: 0603; Mounted: Yes; Sense: No; Socket: No; SMD: Yes; Manufacturer1 Example: NIC COMPONENT; Manufacturer1 ComponentHeight: 0.55mm; HelpURL: \\cern.ch\dfs\Applications\Altium\Datasheets\R0603_NIC_NRC.pdf; Author: CERN DEM JLC; CreateDate: 03.12.2007; LatestRevisionDate: 13.03.2008
R122 = R0603_82K_1%_0.1W_100PPM: Resistor - 1%; Part Description: General Purpose Thick Film Chip Resistor; Manufacturer: GENERIC; Manufacturer1 Part Number: NRC06F8202TRF; Power: 0.1W; TC: ±100ppm/°C; Part Number: R0603_82K_1%_0.1W_100PPM; Component Kind: Standard; Component Type: Standard; Pin Count: 2; Value: 82k; Status: Preferred; Tolerance: ±1%; Manufacturer Part Number: R0603_82K_1%_0.1W_100PPM; Case: 0603; Mounted: Yes; Sense: No; Socket: No; SMD: Yes; Manufacturer1 Example: NIC COMPONENT; Manufacturer1 ComponentHeight: 0.55mm; HelpURL: \\cern.ch\dfs\Applications\Altium\Datasheets\R0603_NIC_NRC.pdf; Author: CERN DEM JLC; CreateDate: 03.12.2007; LatestRevisionDate: 13.03.2008
SW5 SW6 = SW_TYCO_1-1571983-0: 8 Ways SPST DIP Switch; Part Description: 8 Way SPST SMD DIP Switch, Latched, Contact Rating 0.025A 24VDC; Manufacturer: TYCO; Manufacturer Part Number: 1-1571983-0 or GDH08S04; PressFit: No; Part Number: SW_TYCO_1-1571983-0; Component Kind: Standard; Component Type: Standard; Pin Count: 16; PackageDescription: Pitch 1.27mm,  Body 11.28x6.2mm, 8 Ways SPST Surface-Mount DIP Switch,TYCO GDH Serie; Family: Switch; Mounted: Yes; Socket: No; SMD: Yes; Sense: No; Status: None; ComponentHeight: 2.31mm; HelpURL: \\cern.ch\dfs\Applications\Altium\Datasheets\SW_TYCO_1-1571983-0.pdf; Author: CERN DEM JLC; CreateDate: 08.01.2009; LatestRevisionDate: 08.01.2009